# EAGLE schematic BJT CC (EAGLE 8.2.2)
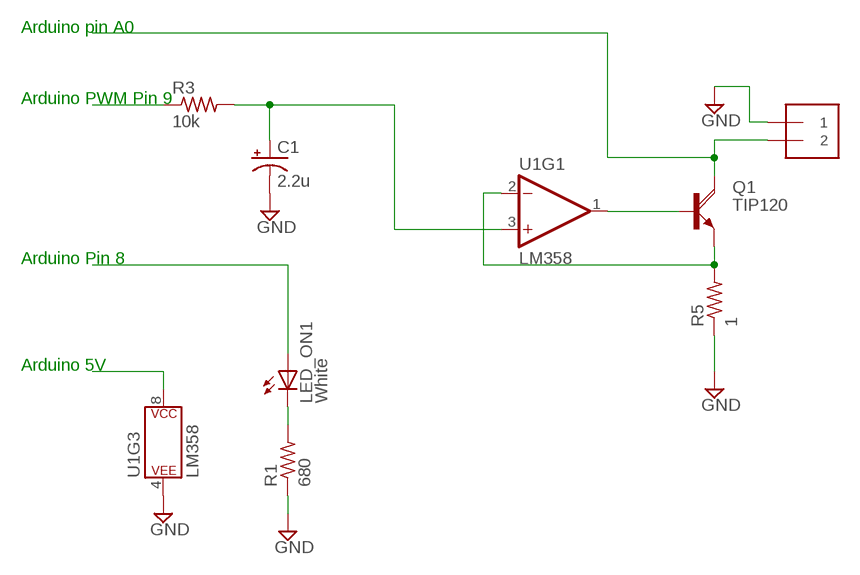
[diagram p0: schematic, sheet 1]

## Parts
BAT_IN  1X2-3.5MM  [1X2-3.5MM]
C1  2.2u  CPOL-USE2-4  [E2-4]
LED_ON1  White  LED5MM  [LED5MM]
Q1  TIP120  [TO220AH]
R1  680  R-US_0207/10  [0207/10]
R3  10k  R-US_0207/10  [0207/10]
R5  1  R-US_0922/22  [0922/22]
U1  LM358  [DIP08]

## Nets
GND: BAT_IN.1 C1.- R1.1 R5.1 U1.4(P$V-)
N$1: LED_ON1.A
N$2: LED_ON1.K(C) R1.2
N$3: U1.8(P$V+)
N$4: C1.+ R3.2 U1.3(+IN)
N$5: Q1.B U1.1(OUT)
N$6: R3.1
N$7: BAT_IN.2 Q1.C
N$8: Q1.E R5.2 U1.2(-IN)
Unconnected: U1.5(+IN) U1.6(-IN) U1.7(OUT)

## Notes on the sheet
- Arduino pin A0
- Arduino PWM Pin 9
- Arduino Pin 8
- Arduino 5V

## Library data of the parts
BAT_IN = adafruit:1X2: 3.5mm Terminal block http://www.ladyada.net/library/pcb/eaglelibrary.html
C1 = adafruit:CPOL-US: POLARIZED CAPACITOR, American symbol
LED_ON1 = adafruit:LED: LED OSRAM: - CHIPLED LG R971, LG N971, LY N971, LG Q971, LY Q971, LO R971, LY R971 LH N974, LH R974 LS Q976, LO Q976, LY Q976 LO Q996 - Hyper CHIPLED LW Q18S LB Q993, LB Q99A, LB R99A - SideLED LS A670, LO A670, LY A670, LG A670, LP A670 LB A673, LV A673, LT A673, LW A673 LH A674 LY A675 LS A676, LA A676, LO A676, LY A676, LW A676 LS A679, LY A679, LG A679 - Hyper Micro SIDELED® LS Y876, LA Y876, LO Y876, LY Y876 LT Y87S - SmartLED LW L88C, LW L88S LB L89C, LB L89S, LG L890 LS L89K, LO L89K, LY L89K LS L896, LA L896, LO L896, LY L896 - TOPLED LS T670, LO T670, LY T670, LG T670, LP T670 LSG T670, LSP T670, LSY T670, LOP T670, LYG T670 LG T671, LOG T671, LSG T671 LB T673, LV T673, LT T673, LW T673 LH T674 LS T676, LA T676, LO T676, LY T676, LB T676, LH T676, LSB T676, LW T676 LB T67C, LV T67C, LT T67C, LS T67K, LO T67K, LY T67K, LW E67C LS E67B, LA E67B, LO E67B, LY E67B, LB E67C, LV E67C, LT E67C LW T67C LS T679, LY T679, LG T679 LS T770, LO T770, LY T770, LG T770, LP T770 LB T773, LV T773, LT T773, LW T773 LH T774 LS E675, LA E675, LY E675, LS T675 LS T776, LA T776, LO T776, LY T776, LB T776 LHGB T686 LT T68C, LB T68C - Hyper Mini TOPLED® LB M676 - Mini TOPLED Santana® LG M470 LS M47K, LO M47K, LY M47K Source: http://www.osram.convergy.de/
Q1 = transistor-power:TIP120: NPN DARLINGTON TRANSISTOR
R1 R3 = resistor:R-US_: RESISTOR, American symbol
R5 = adafruit:R-US_: RESISTOR, American symbol
U1 = SparkFun-IC-Amplifiers:LM358: LM358 Jellybean op-amp Datasheet <http://www.sparkfun.com/datasheets/Components/General/LM358.pdf> SparkFun Products Op-Amp (Thru-Hole) - LM358 <https://www.sparkfun.com/products/9456> (COM-09456); PROD_ID: IC-09172

## Net classes
0 default: width 0.305 mm, drill 0.508 mm, clearance 0.254 mm